# Altium schematic sheet FET PWM output.SchDoc
size A; DocumentNumber: 4; SheetNumber: 4; SheetTotal: 4
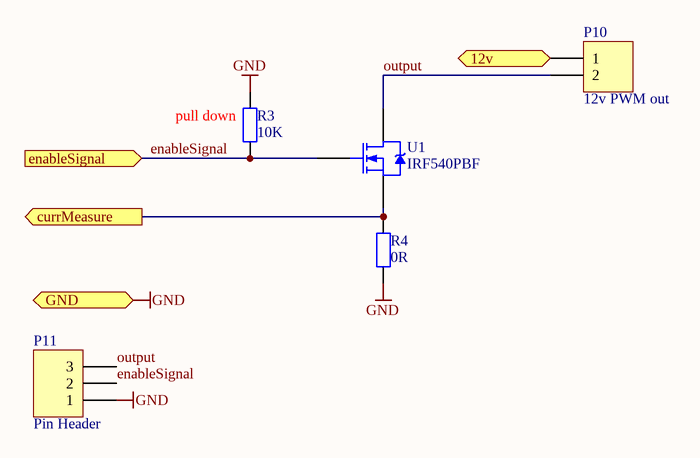
[diagram p0: FET PWM output.SchDoc]

## Parts
P10  12v PWM out  [TB2_5.08]
P11  Pin Header  [PH1x3_2.54]
R3  value 10K  [R0805]  (hidden comment: RESISTOR)
R4  value 0R  [R0805]  (hidden comment: RESISTOR)
U1  IRF540PBF  [TO-220AB]

## Ports
12v, currMeasure (out), enableSignal (in), GND

## Nets
GND: P11.1 R3.1 R4.2 ; port GND
12v: P10.1 ; port 12v
currMeasure: R4.1 U1.3(S) ; port currMeasure
enableSignal: P11.2 R3.2 U1.1(G) ; port enableSignal
output: P10.2 P11.3 U1.2(D)

## Notes on the sheet
- (near R3) pull down

## Library data of the parts
P10 = TB2: Con1x2; Part Number: TB2; Current: 10; Voltage: 300; Pitch: 5.08; LatestRevision Note: Initial Release; Type: Terminal Block; Number Of Pins: 2; Component Type: Standard; LatestRevision Date: 23-Nov-10; Author: Bram van Rensen
P11 = PH1x3: Con1x3; Part Number: PH1x3; Pitch: 2.54; LatestRevision Note: Initial Release; Type: Pin Header; Number Of Pins: 3; Component Type: Standard; LatestRevision Date: 23-Nov-10; Author: Willy Pietersz; Supplier 1: Farnell
R3 = 10K: Manufacturer 1: Panasonic; Manufacturer 1 Part No: ERJT06J103V; Power: 0.25W; Tolerance: 0.05; LatestRevision Note: Initial Release; Published: 8-Jun-2000; LatestRevisionDate: 17-Jul-2002; LatestRevisionNote: Re-released for DXP Platform.; PackageReference: AXIAL-0.4; Publisher: Altium Limited; Part Number: 10K; Type: Film; Package: 0805; Component Type: Standard; LatestRevision Date: 30-Jul-10; Author: Willy Pietersz; ROHS: Y; Supplier 1: Farnell; Supplier Part Number 1: 1618242; ComponentLink1Description: Manufacturer; ComponentLink2Description: Datasheet
R4 = 0R: Published: 8-Jun-2000; LatestRevisionDate: 17-Jul-2002; LatestRevisionNote: Re-released for DXP Platform.; PackageReference: AXIAL-0.4; Publisher: Altium Limited; Part Number: 0R; Package: 0805; Component Type: Standard; Supplier 1: Farnell; Supplier Part Number 1: 1469846
U1 = IRF540PBF: Transistor; Manufacturer 1: IRF; Ron: 0.077; Current: 28; Voltage: 100; LatestRevision Note: Initial Release; Part Number: IRF540PBF; Type: NMOS; Component Type: Standard; LatestRevision Date: 31-7-2010; Author: Willy Pietersz; ROHS: Y; Manufacturer 1 Part No: IRF540PBF; Supplier 1: Farnell; Supplier Part Number 1: 1653661; ComponentLink1Description: Manufacturer; ComponentLink1URL: http://www.irf.com; ComponentLink2Description: Datasheet; ComponentLink2URL: http://www.vishay.com/docs/91021/91021.pdf